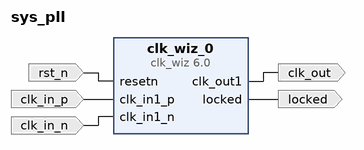
[diagram p0: block diagram of the top level]
# Vivado block design sys_pll, xcvu9p-flga2104-2L-e, Vivado 2018.2
create_bd_design sys_pll

create_bd_port -dir I -type rst rst_n
create_bd_port -dir O -type clk clk_out
create_bd_port -dir O -type data locked
create_bd_port -dir I clk_in_p
create_bd_port -dir I clk_in_n

create_bd_cell -type ip -vlnv xilinx.com:ip:clk_wiz:6.0 clk_wiz_0
set_property -dict [list \
  CONFIG.PRIMITIVE PLL \
  CONFIG.PRIM_IN_FREQ 156.25 \
  CONFIG.CLKIN1_JITTER_PS 64.0 \
  CONFIG.CLKOUT1_REQUESTED_OUT_FREQ 50 \
  CONFIG.PRIM_SOURCE Differential_clock_capable_pin \
  CONFIG.CLKOUT1_DRIVES BUFG \
  CONFIG.CLKOUT2_DRIVES Buffer \
  CONFIG.CLKOUT3_DRIVES Buffer \
  CONFIG.CLKOUT4_DRIVES Buffer \
  CONFIG.CLKOUT5_DRIVES Buffer \
  CONFIG.CLKOUT6_DRIVES Buffer \
  CONFIG.CLKOUT7_DRIVES Buffer \
  CONFIG.RESET_PORT resetn \
  CONFIG.OVERRIDE_MMCM true \
  CONFIG.MMCM_DIVCLK_DIVIDE 1 \
  CONFIG.MMCM_CLKFBOUT_MULT_F 8 \
  CONFIG.MMCM_CLKIN1_PERIOD 6.400 \
  CONFIG.MMCM_CLKIN2_PERIOD 10.000 \
  CONFIG.MMCM_COMPENSATION AUTO \
  CONFIG.MMCM_CLKOUT0_DIVIDE_F 25 \
  CONFIG.RESET_TYPE ACTIVE_LOW \
  CONFIG.CLK_IN1_BOARD_INTERFACE Custom \
  CONFIG.CLKOUT1_JITTER 123.168 \
  CONFIG.CLKOUT1_PHASE_ERROR 83.183 \
] [get_bd_cells clk_wiz_0]

# ---- connections ----

connect_bd_net [get_bd_ports rst_n] [get_bd_pins clk_wiz_0/resetn]
connect_bd_net [get_bd_pins clk_wiz_0/clk_out1] [get_bd_ports clk_out]
connect_bd_net [get_bd_pins clk_wiz_0/locked] [get_bd_ports locked]
connect_bd_net [get_bd_ports clk_in_p] [get_bd_pins clk_wiz_0/clk_in1_p]
connect_bd_net [get_bd_ports clk_in_n] [get_bd_pins clk_wiz_0/clk_in1_n]

validate_bd_design
save_bd_design
